# Altium schematic sheet H_bridge.SchDoc
size C
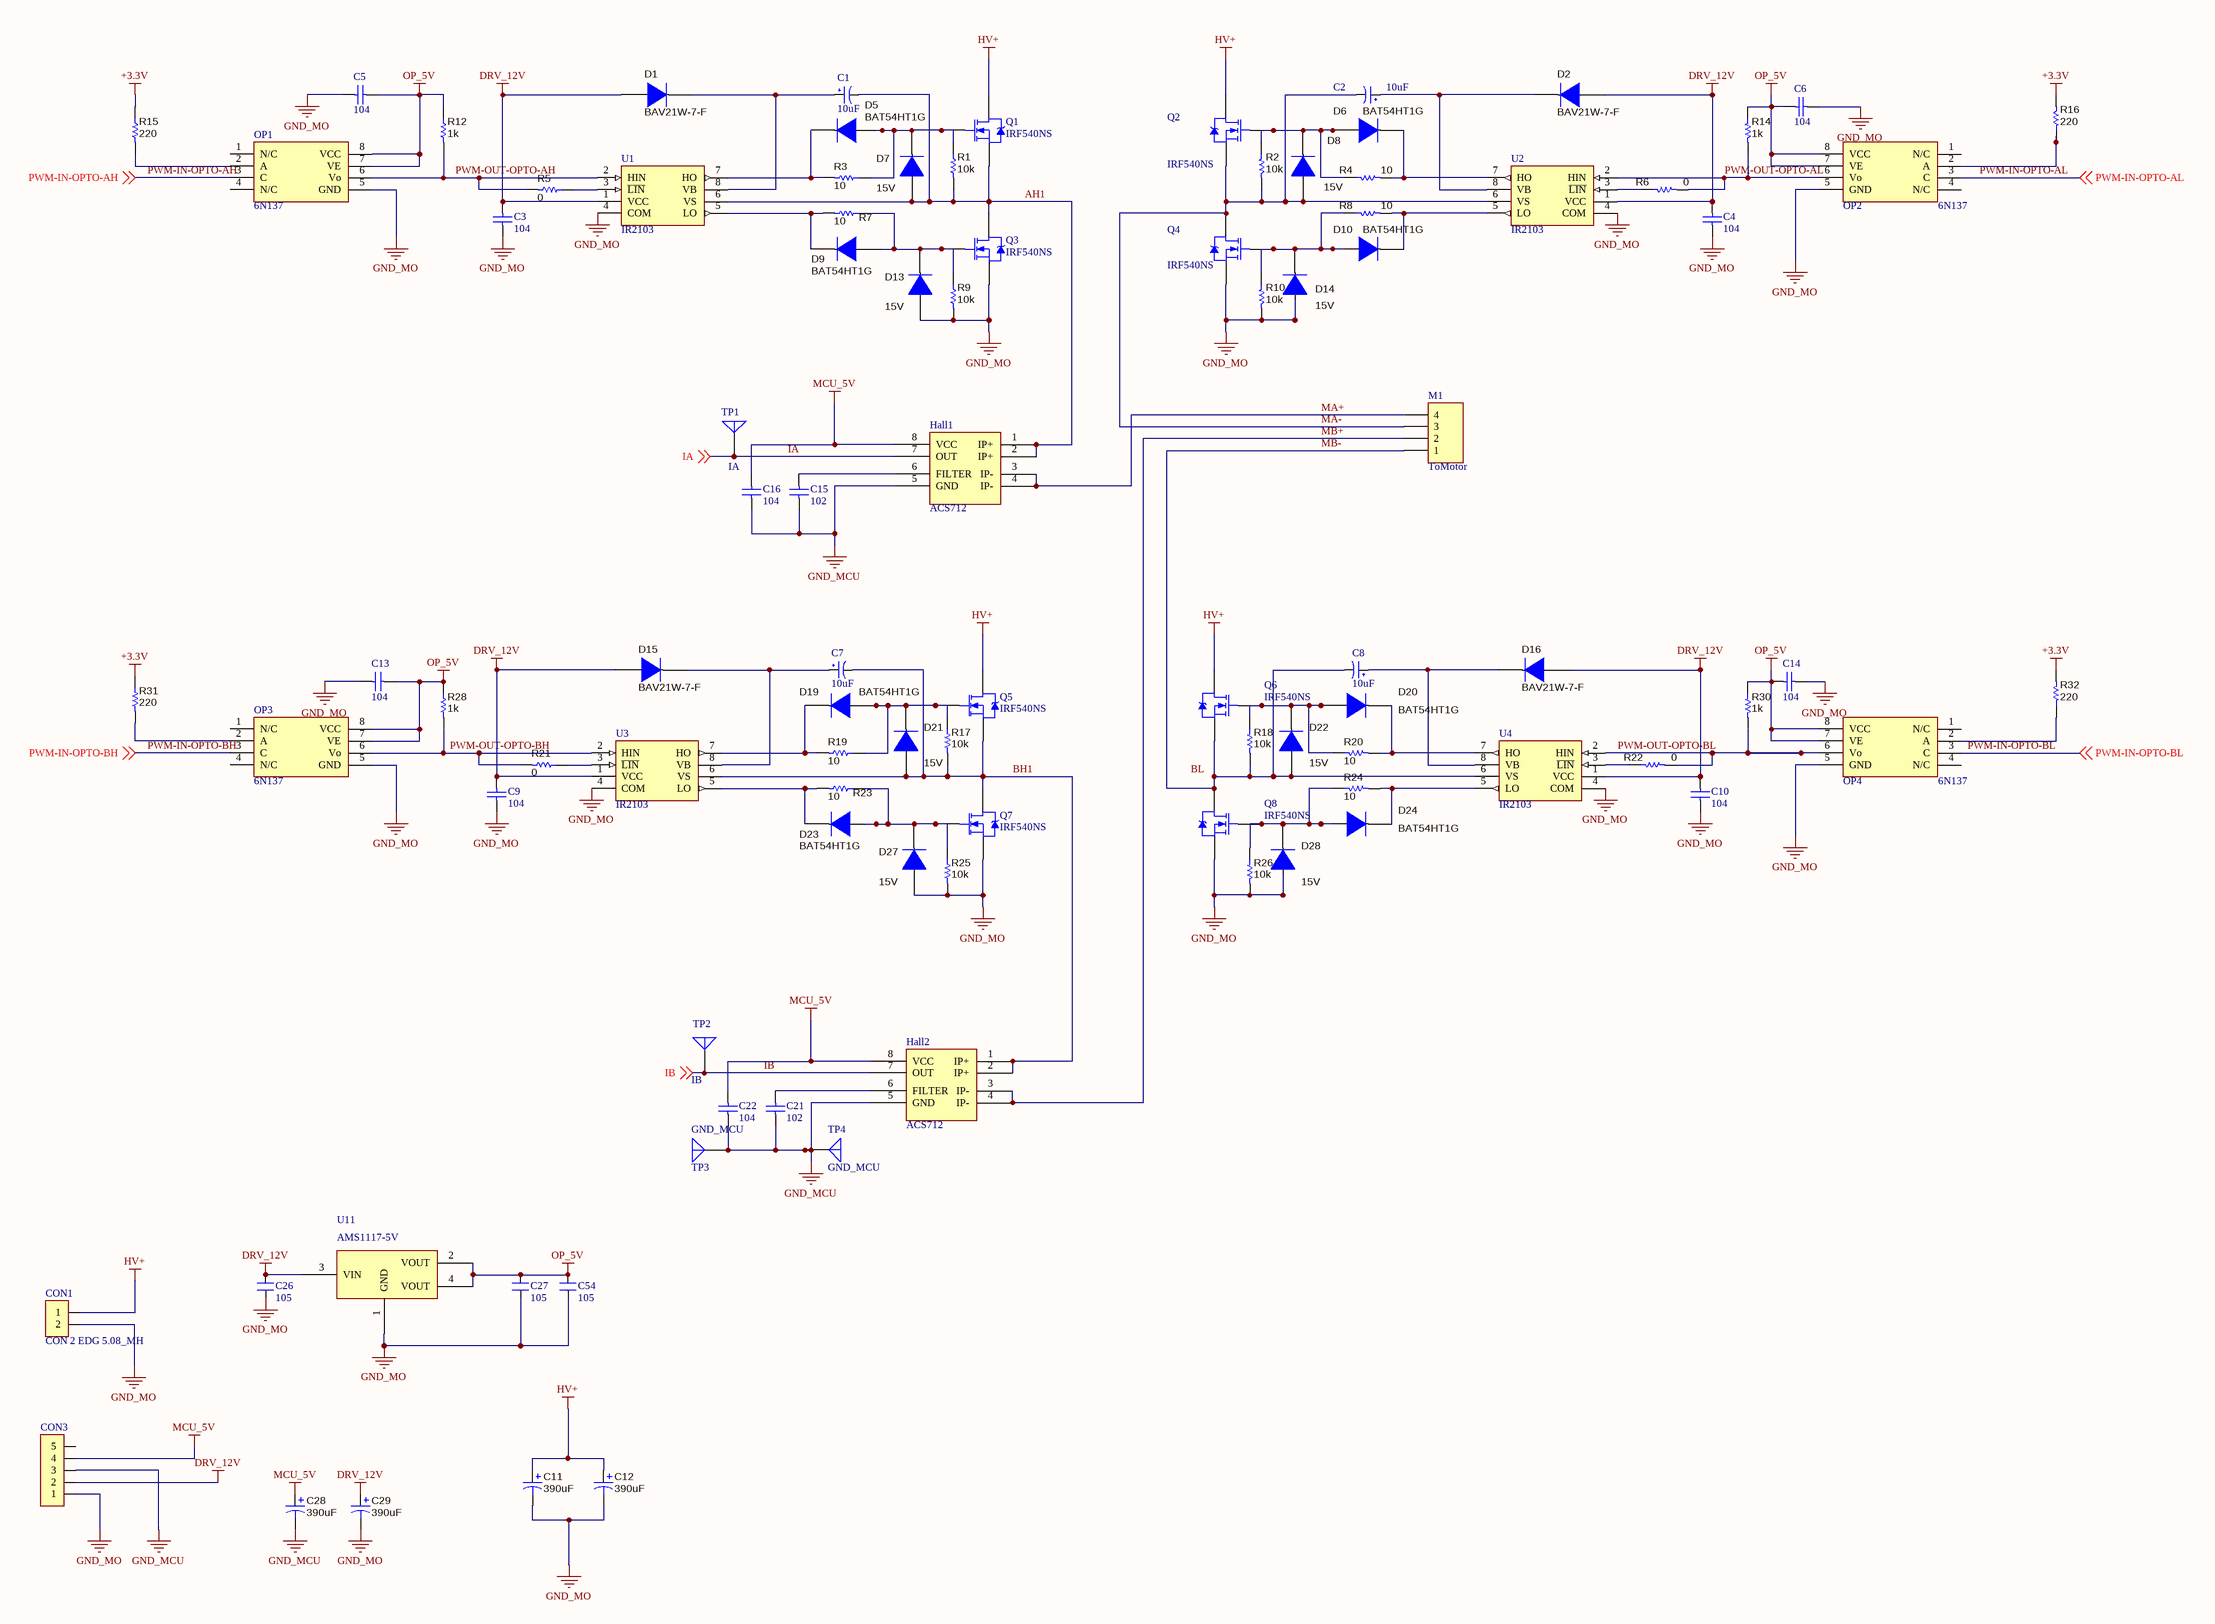
[diagram p0: H_bridge.SchDoc]

## Parts
C1  10uF  [TU_NHOM_10uF_MH]
C2  10uF  [TU_NHOM_10uF_MH]
C3  104  [TU_SMD_0805]
C4  104  [TU_SMD_0805]
C5  104  [TU_SMD_0805]
C6  104  [TU_SMD_0805]
C7  10uF  [TU_NHOM_10uF_MH]
C8  10uF  [TU_NHOM_10uF_MH]
C9  104  [TU_SMD_0805]
C10  104  [TU_SMD_0805]
C11  390uF  [CAP_12.5 X 25]
C12  390uF  [CAP_12.5 X 25]
C13  104  [TU_SMD_0805]
C14  104  [TU_SMD_0805]
C15  102  [TU_SMD_0805]
C16  104  [TU_SMD_0805]
C21  102  [TU_SMD_0805]
C22  104  [TU_SMD_0805]
C26  105  [0805_HV]
C27  105  [0805_HV]
C28  390uF  [CP1/3.0]
C29  390uF  [CP1/3.0]
C54  105  [0805_HV]
CON1  CON 2 EDG 5.08_MH  [CON 2 EDG 5.08]
CON3  CON 5 EDG 5.08_MH  [Con 5 EDG 5.08]  (value not drawn)
D1  BAV21W-7-F  [SOD-323]
D2  BAV21W-7-F  [SOD-323]
D5  BAT54HT1G  [SOD-323]
D6  BAT54HT1G  [SOD-323]
D7  15V  [SOD-323]
D8  15V  [SOD-323]
D9  BAT54HT1G  [SOD-323]
D10  BAT54HT1G  [SOD-323]
D13  15V  [SOD-323]
D14  15V  [SOD-323]
D15  BAV21W-7-F  [SOD-323]
D16  BAV21W-7-F  [SOD-323]
D19  BAT54HT1G  [SOD-323]
D20  BAT54HT1G  [SOD-323]
D21  15V  [SOD-323]
D22  15V  [SOD-323]
D23  BAT54HT1G  [SOD-323]
D24  BAT54HT1G  [SOD-323]
D27  15V  [SOD-323]
D28  15V  [SOD-323]
Hall1  ACS712  [SOP 8]
Hall2  ACS712  [SOP 8]
M1  ToMotor  [Con 4 EDG 5.08]
OP1  6N137 DIP8 Opto 10Mbit  [SMD-8_6.3MM]  (value not drawn)
OP2  6N137 DIP8 Opto 10Mbit  [SMD-8_6.3MM]  (value not drawn)
OP3  6N137 DIP8 Opto 10Mbit  [SMD-8_6.3MM]  (value not drawn)
OP4  6N137 DIP8 Opto 10Mbit  [SMD-8_6.3MM]  (value not drawn)
Q1  IRF540NS  [D2PAK_M_1]
Q2  IRF540NS  [D2PAK_M_1]
Q3  IRF540NS  [D2PAK_M_1]
Q4  IRF540NS  [D2PAK_M_1]
Q5  IRF540NS  [D2PAK_M_1]
Q6  IRF540NS  [D2PAK_M_1]
Q7  IRF540NS  [D2PAK_M_1]
Q8  IRF540NS  [D2PAK_M_1]
R1  10k  [Tro SMD 0805]
R2  10k  [Tro SMD 0805]
R3  10  [Tro SMD 0805]
R4  10  [Tro SMD 0805]
R5  0  [Tro SMD 0805]
R6  0  [Tro SMD 0805]
R7  10  [Tro SMD 0805]
R8  10  [Tro SMD 0805]
R9  10k  [Tro SMD 0805]
R10  10k  [Tro SMD 0805]
R12  1k  [Tro SMD 0805]
R14  1k  [Tro SMD 0805]
R15  220  [Tro SMD 0805]
R16  220  [Tro SMD 0805]
R17  10k  [Tro SMD 0805]
R18  10k  [Tro SMD 0805]
R19  10  [Tro SMD 0805]
R20  10  [Tro SMD 0805]
R21  0  [Tro SMD 0805]
R22  0  [Tro SMD 0805]
R23  10  [Tro SMD 0805]
R24  10  [Tro SMD 0805]
R25  10k  [Tro SMD 0805]
R26  10k  [Tro SMD 0805]
R28  1k  [Tro SMD 0805]
R30  1k  [Tro SMD 0805]
R31  220  [Tro SMD 0805]
R32  220  [Tro SMD 0805]
TP1  IA  [PIN1]
TP2  IB  [PIN1]
TP3  GND_MCU  [PIN1]
TP4  GND_MCU  [PIN1]
U1  IR2103  [SOP 8]
U2  IR2103  [SOP 8]
U3  IR2103  [SOP 8]
U4  IR2103  [SOP 8]
U11  AMS1117-5V  [SOT223]

## Nets
+3.3V: R15.1 R16.2 R31.1 R32.2
DRV_12V: C3.2 C4.2 C9.2 C10.2 C26.2 C29.1(+) CON3.2 D1.2(A) D2.2(A) D15.2(A) D16.2(A) U1.1(VCC) U2.1(VCC) U3.1(VCC) U4.1(VCC) U11.3(VIN)
GND_MCU: C15.1 C16.1 C21.1 C22.1 C28.2(-) CON3.3 Hall1.5(GND) Hall2.5(GND) TP3.1(A) TP4.1(A)
GND_MO: C3.1 C4.1 C5.2 C6.2 C9.1 C10.1 C11.2(-) C12.2(-) C13.2 C14.2 C26.1 C27.1 C29.2(-) C54.1 CON1.2 CON3.1 D13.2(A) D14.2(A) D27.2(A) D28.2(A) OP1.5(GND) OP2.5(GND) OP3.5(GND) OP4.5(GND) Q3.3(S) Q4.3(S) Q7.3(S) Q8.3(S) R9.2 R10.2 R25.2 R26.2 U1.4(COM) U2.4(COM) U3.4(COM) U4.4(COM) U11.1(GND)
HV+: C11.1(+) C12.1(+) CON1.1 Q1.2(D) Q2.2(D) Q5.2(D) Q6.2(D)
MCU_5V: C16.2 C22.2 C28.1(+) CON3.4 Hall1.8(VCC) Hall2.8(VCC)
OP_5V: C5.1 C6.1 C13.1 C14.1 C27.2 C54.2 OP1.7(VE) OP1.8(VCC) OP2.7(VE) OP2.8(VCC) OP3.7(VE) OP3.8(VCC) OP4.7(VE) OP4.8(VCC) R12.1 R14.1 R28.1 R30.1 U11.2(VOUT) U11.4(VOUT)
AH1: C1.2 D7.2(A) Hall1.1(IP+) Hall1.2(IP+) Q1.3(S) Q3.2(D) R1.2 U1.6(VS)
BH1: C7.2 D21.2(A) Hall2.1(IP+) Hall2.2(IP+) Q5.3(S) Q7.2(D) R17.2 U3.6(VS)
IA: Hall1.7(OUT) TP1.1(A) ; off-sheet IA
IB: Hall2.7(OUT) TP2.1(A) ; off-sheet IB
MA+: Hall1.3(IP-) Hall1.4(IP-) M1.4
MA-: C2.2 D8.2(A) M1.3 Q2.3(S) Q4.2(D) R2.2 U2.6(VS)
MB+: Hall2.3(IP-) Hall2.4(IP-) M1.2
MB-: C8.2 D22.2(A) M1.1 Q6.3(S) Q8.2(D) R18.2 U4.6(VS)
PWM-IN-OPTO-AH: OP1.3(C) ; off-sheet PWM-IN-OPTO-AH
PWM-IN-OPTO-AL: OP2.3(C) ; off-sheet PWM-IN-OPTO-AL
PWM-IN-OPTO-BH: OP3.3(C) ; off-sheet PWM-IN-OPTO-BH
PWM-IN-OPTO-BL: OP4.3(C) ; off-sheet PWM-IN-OPTO-BL
PWM-OUT-OPTO-AH: OP1.6(Vo) R5.2 R12.2 U1.2(HIN)
PWM-OUT-OPTO-AL: OP2.6(Vo) R6.2 R14.2 U2.2(HIN)
PWM-OUT-OPTO-BH: OP3.6(Vo) R21.2 R28.2 U3.2(HIN)
PWM-OUT-OPTO-BL: OP4.6(Vo) R22.2 R30.2 U4.2(HIN)
NetC1_1: C1.1 D1.1(K) U1.8(VB)
NetC2_1: C2.1 D2.1(K) U2.8(VB)
NetC7_1: C7.1 D15.1(K) U3.8(VB)
NetC8_1: C8.1 D16.1(K) U4.8(VB)
NetC15_2: C15.2 Hall1.6(FILTER)
NetC21_2: C21.2 Hall2.6(FILTER)
NetD5_1: D5.1(K) R3.2 U1.7(HO)
NetD5_2: D5.2(A) D7.1(K) Q1.1(G) R1.1 R3.1
NetD6_1: D6.1(K) R4.2 U2.7(HO)
NetD6_2: D6.2(A) D8.1(K) Q2.1(G) R2.1 R4.1
NetD9_1: D9.1(K) R7.2 U1.5(LO)
NetD9_2: D9.2(A) D13.1(K) Q3.1(G) R7.1 R9.1
NetD10_1: D10.1(K) R8.2 U2.5(LO)
NetD10_2: D10.2(A) D14.1(K) Q4.1(G) R8.1 R10.1
NetD19_1: D19.1(K) R19.2 U3.7(HO)
NetD19_2: D19.2(A) D21.1(K) Q5.1(G) R17.1 R19.1
NetD20_1: D20.1(K) R20.2 U4.7(HO)
NetD20_2: D20.2(A) D22.1(K) Q6.1(G) R18.1 R20.1
NetD23_1: D23.1(K) R23.2 U3.5(LO)
NetD23_2: D23.2(A) D27.1(K) Q7.1(G) R23.1 R25.1
NetD24_1: D24.1(K) R24.2 U4.5(LO)
NetD24_2: D24.2(A) D28.1(K) Q8.1(G) R24.1 R26.1
NetOP1_2: OP1.2(A) R15.2
NetOP2_2: OP2.2(A) R16.1
NetOP3_2: OP3.2(A) R31.2
NetOP4_2: OP4.2(A) R32.1
NetR5_1: R5.1 U1.3(~{LIN})
NetR6_1: R6.1 U2.3(~{LIN})
NetR21_1: R21.1 U3.3(~{LIN})
NetR22_1: R22.1 U4.3(~{LIN})

Not connected (* = marked no-connect by the designer): CON3 5; OP1 1(N/C) 4(N/C); OP2 1(N/C) 4(N/C); OP3 1(N/C) 4(N/C); OP4 1(N/C) 4(N/C)

## Notes on the sheet
- Labels drawn without touching a wire or pin: BL

## Library data of the parts
C1 C2 C7 C8 = TU_NHOM_10uF_25V_MH: Value: 47uF/16 - 50V; Description 1: 470uF/6,3V - 330uF/10V - 220uF/16V; Description 2: 100uF/25V - 35V - 47uF/50V - 22uF/100V; Description 3: 33uF => 47uF/63V - 1uF => 4,7uF/160V; Description 4: 1uF => 2,2uF/250V - 1uF/350V
C3-C6 C9 C10 C13-C16 C21 C22 = Capacitor 0805: Ceramic Chip Capacitor - Standard; Note: Footprint corresponds to dimensions for bulk cassette packaging. This case size has tightened tolerances.; Published: 17-Jul-2002; LatestRevisionDate: 19-Mar-2004; LatestRevisionNote: Silkscreen size reduced.; DatasheetDocument: Mar-2001; PackageDocument: Mar-2001; PackageReference: 0805; Publisher: Altium Limited; Code_JEITA: 0805; Code_IPC: 2012[0805]; ComponentLink1Description: Manufacturer Link; ComponentLink1URL: http://www.kemet.com/; ComponentLink2Description: Datasheet; ComponentLink2URL: http://www.kemet.com/kemet/web/homepage/kechome.nsf/vapubfilesname/F3102TA.pdf/$file/F3102TA.pdf
  C3-C6 C9 C10 C13 C14 C16 C22: Value: 104
  C15 C21: Value: 102
C11 C12 = Capacitor TuHoa: CAP ALUM 390UF 20% 50V RADIAL; PartNumber: UHW1H391MPD6; Manufacturer: Nichicon; Polarized: Y; U/M: EA; Cap_F: 0.000390; Tolerance_%: 20; Value1: Unknown; VDC_V: 50; TaMin_C: -40; TaMax_C: 105; Cap_Case: 10x22; AEC Category: Q200; AEC Qualified: N; CompType: Capacitor; SymbolVersion: 2008-07-09; Value: 390uF; PackageReference: 10x22; RoHS: Y; Value2: 50V; MountType: TH; Technology: AL; Series: ZL; Publisher: Texas Instruments; LatestRevisionDate: 2015-12-17; ComponentLink1Description: Datasheet link; ComponentLink1URL: http://nichicon-us.com/english/products/pdfs/e-uhw.pdf; Supplier 1: Digi-Key; Supplier Part Number 1: 493-6885-ND; AEC Grade: N/A; ValueDisplayed: 390uF
C26 C27 C54 = CM: Cap SMD; Value: 103
C28 C29 = Capacitor TuHoa: PartNumber: UHW1H391MPD6; Manufacturer: Nichicon; Polarized: Y; U/M: EA; Cap_F: 0.000390; Tolerance_%: 20; Value1: Unknown; VDC_V: 50; Value2: 50V; TaMin_C: -40; TaMax_C: 105; Cap_Case: 10x22; AEC Category: Q200; AEC Qualified: N; CompType: Capacitor; SymbolVersion: 2008-07-09; Value: 390uF; PackageReference: 10x22; RoHS: Y; MountType: TH; Technology: AL; Series: ZL; Publisher: Texas Instruments; LatestRevisionDate: 2015-12-17; ComponentLink1Description: Datasheet link; ComponentLink1URL: http://nichicon-us.com/english/products/pdfs/e-uhw.pdf; Supplier 1: Digi-Key; Supplier Part Number 1: 493-6885-ND; AEC Grade: N/A; ValueDisplayed: 390uF
CON1 = CON 2 EDG 5.08_MH: CON 2 EDG 5.08 (xanh cong)
CON3 = CON 5 EDG 5.08_MH: CON 5 EDG 5.08 (xanh cong)
D1 D2 D5 D6 D9 D10 D15 D16 D19 D20 D23 D24 = MMDL914-TP: Diode, Switching, 100 V, 0.2 A, SOD-323; Manufacturer: Micro Commercial Components; U/M: EA; Vf_V: 1; Value: 100V; Value1: 0.2A; Value2: 1V; Io_A: 0.2; Vr_V: 100; TJmax_C: 150; SizeAreaWB_mm2: 8.695; SizeArea_mm2: 3.645; SizeX_mm: 2.7; SizeY_mm: 1.35; AEC Category: Q101; SymbolVersion: 2008-12-08; PackageReference: SOD-323; CompType: Diode; MountType: SMT; Type: Switching; RoHS: Y; SizeZ_mm: 1; Published: 2008-06-26; Publisher: Texas Instruments; LatestRevisionDate: 2016-10-18; ComponentLink1Description: Datasheet link; ComponentLink1URL: http://www.mccsemi.com/up_pdf/MMDL914(SOD-323).pdf; Supplier 1: Digi-Key; Supplier Part Number 1: MMDL914-TPMSCT-ND; AEC Qualified: ?
  D1 D2 D15 D16: PartNumber: BAV21W-7-F
  D5 D6 D9 D10 D19 D20 D23 D24: PartNumber: BAT54HT1G
D7 D8 D13 D14 D21 D22 D27 D28 = MMDL914-TP: Diode, Switching, 100 V, 0.2 A, SOD-323; PartNumber: BAV21W-7-F; Manufacturer: Micro Commercial Components; U/M: EA; Vf_V: 1; Value: 100V; Value1: 0.2A; Value2: 1V; Io_A: 0.2; Vr_V: 100; TJmax_C: 150; SizeAreaWB_mm2: 8.695; SizeArea_mm2: 3.645; SizeX_mm: 2.7; SizeY_mm: 1.35; AEC Category: Q101; SymbolVersion: 2008-12-08; PackageReference: SOD-323; CompType: Diode; MountType: SMT; Type: Switching; RoHS: Y; SizeZ_mm: 1; Published: 2008-06-26; Publisher: Texas Instruments; LatestRevisionDate: 2016-10-18; ComponentLink1Description: Datasheet link; ComponentLink1URL: http://www.mccsemi.com/up_pdf/MMDL914(SOD-323).pdf; Supplier 1: Digi-Key; Supplier Part Number 1: MMDL914-TPMSCT-ND; AEC Qualified: ?
M1 = Header 4: Header, 4-Pin; LatestRevisionDate: 17-Jul-2002; LatestRevisionNote: Re-released for DXP Platform.; Publisher: Altium Limited
OP1-OP4 = 6N137: 6N137 DIP8 Opto 10Mbit/s
Q1-Q8 = IRF540NS: HEXFET Power MOSFET; Published: 8-Jun-2000; LatestRevisionDate: 20-Nov-2009; LatestRevisionNote: IPC-7351 Footprint Added.; DatasheetVersion: May-1998; PackageReference: D2PAK; Publisher: Altium Limited; PackageDescription: 3-Pin Transistor Outline Package 2.54 mm Pitch, 15.1 mm Lead Span; ComponentLink1Description: Manufacturer Link; ComponentLink1URL: http://www.irf.com/; ComponentLink2Description: Datasheet; ComponentLink2URL: http://www.irf.com/product-info/datasheets/data/irf540ns.pdf; Supplier 1: Farnell
R1-R10 R12 R14-R26 R28 R30-R32 = R nho: RES, 100, 1%, 0.1 W, 0402; PartNumber: ERJ-2RKF1000X; Manufacturer: Panasonic; CompType: Resistor; Res_ohm: 100; Value_Code: 100R; Tolerance_%: 1; Power_W: 0.1; Value2: 0.1W; VDC_V: 50; TempCo: 100 ppm/C; EIA_Code: E96; U/M: EA; AEC Category: Q200; SymbolVersion: 2009-05-29; PackageReference: 0402; RoHS: Y; Value1: 1%; MountType: SMT; Technology: Thick Film; Published: 2008-06-26; Publisher: Texas Instruments; LatestRevisionDate: 2016-01-08; ComponentLink1Description: Datasheet link; ComponentLink1URL: http://industrial.panasonic.com/www-data/pdf/AOA0000/AOA0000CE2.pdf; Supplier 1: Digi-Key; Supplier Part Number 1: P100LCT-ND; Supplier 2: Mouser; Supplier Part Number 2: 667-ERJ-2RKF1000X; Supplier 3: Farnell; Supplier Part Number 3: 2304034; AEC Qualified: ?
  R1 R2 R9 R10 R17 R18 R25 R26: Value: 10k
  R3 R4 R7 R8 R19 R20 R23 R24: Value: 10
  R5 R6 R21 R22: Value: 0
  R12 R14 R28 R30: Value: 1k
  R15 R16 R31 R32: Value: 220
TP1-TP4 = Antenna: Generic Antenna; Published: 24-Mar-1999; LatestRevisionDate: 17-Jul-2002; LatestRevisionNote: Re-released for DXP Platform.; PackageReference: PIN1; Publisher: Altium Limited
U1-U4 = IR2103: High and Low Side Driver; Published: 8-Jun-2000; LatestRevisionDate: 04-Mar-2005; LatestRevisionNote: Stylized 3D Model Added.; DatasheetVersion: PD600451; PackageReference: PDIP8; Publisher: Altium Limited; PackageDescription: DIP; 8 Leads; Row Spacing 7.62 mm; Pitch 2.54 mm; Code_JEDEC: MO-001-AN; ComponentLink1Description: Manufacturer Link; ComponentLink1URL: http://www.irf.com/; ComponentLink2Description: Datasheet; ComponentLink2URL: http://www.irf.com/product-info/datasheets/data/ir2103.pdf
U11 = AMS1117-3.3V SOT223 _MH